# Altium schematic sheet Video out.SchDoc
size A4; SheetNumber: 13; SheetTotal: 16
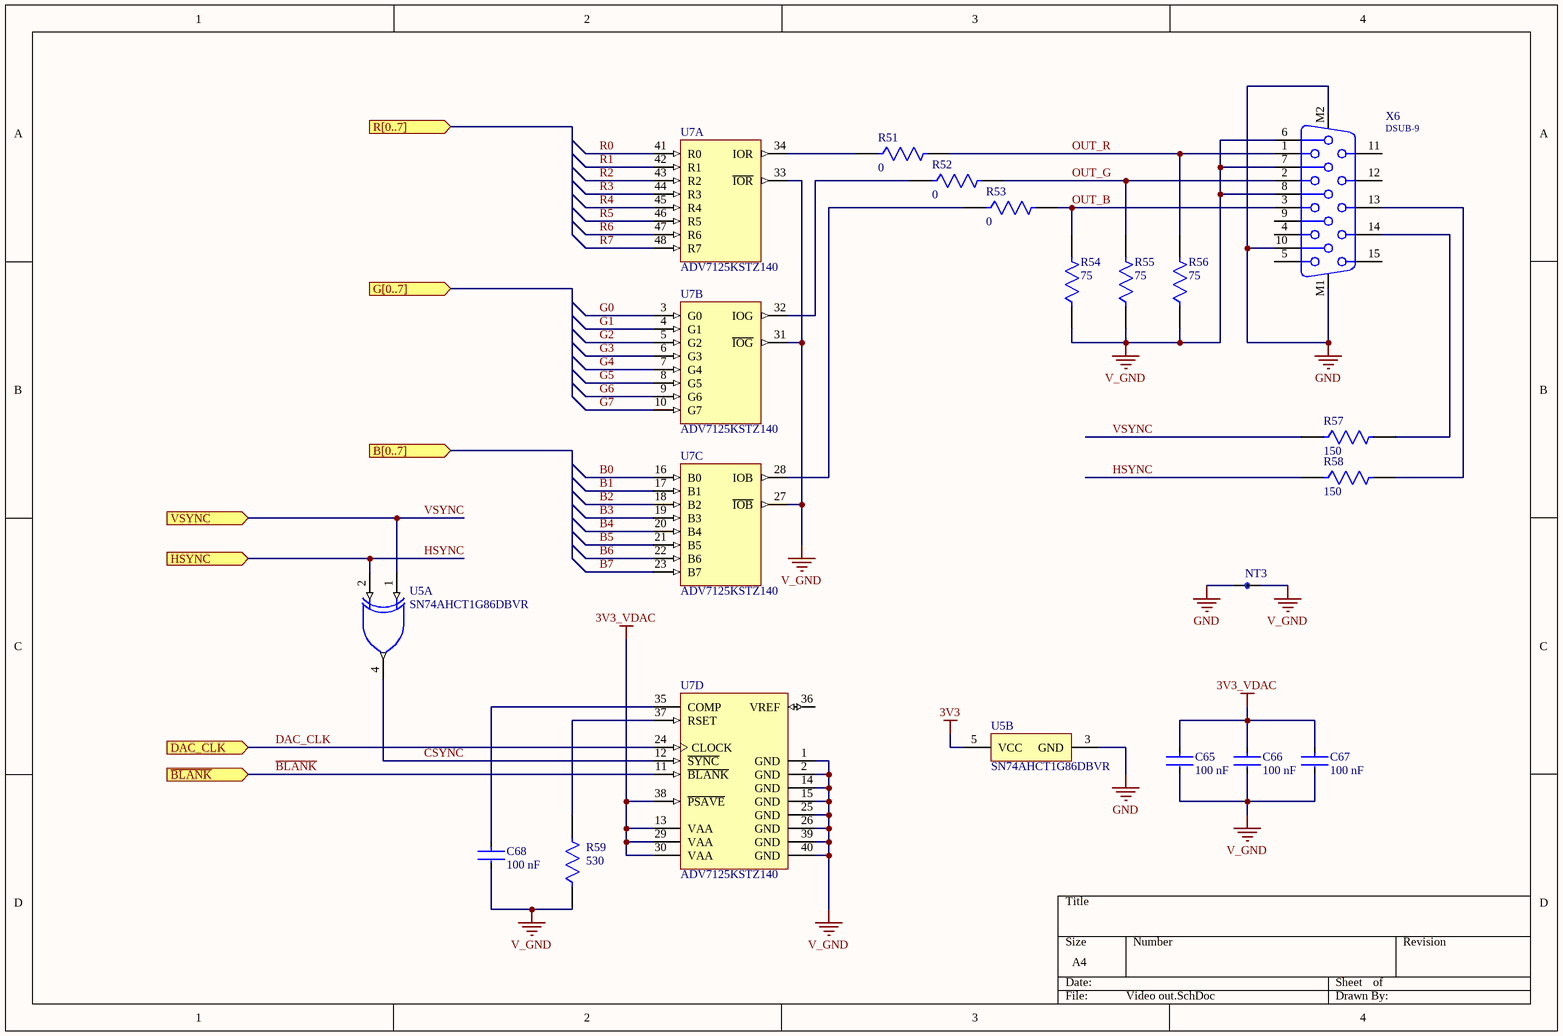
[diagram p0: Video out.SchDoc]

## Parts
C65  Capacitance: 100 nF  [CC0805]  (hidden comment: CC0805-1.5pF)
C66  Capacitance: 100 nF  [CC0805]  (hidden comment: CC0805-1.5pF)
C67  Capacitance: 100 nF  [CC0805]  (hidden comment: CC0805-1.5pF)
C68  Capacitance: 100 nF  [CC0805]  (hidden comment: CC0805-1.5pF)
NT3  net_tie  [NET_TIE]  (value not drawn)  (net tie, no BOM)
R51  Resistance: 0  [CR0805]  (hidden comment: CR0805-51)
R52  Resistance: 0  [CR0805]  (hidden comment: CR0805-51)
R53  Resistance: 0  [CR0805]  (hidden comment: CR0805-51)
R54  Resistance: 75  [CR0805]  (hidden comment: CR0805-51)
R55  Resistance: 75  [CR0805]  (hidden comment: CR0805-51)
R56  Resistance: 75  [CR0805]  (hidden comment: CR0805-51)
R57  Resistance: 150  [CR0805]  (hidden comment: CR0805-51)
R58  Resistance: 150  [CR0805]  (hidden comment: CR0805-51)
R59  Resistance: 530  [CR0805]  (hidden comment: CR0805-51)
U5  SN74AHCT1G86DBVR  [DBV0005A_L]  (parts A,B of 2)
U7  ADV7125KSTZ140  [ST-48_N]  (parts A,B,C,D of 4)
X6  DSUB-9  [618015330923]

## Ports
B[0..7] (in), DAC_CLK (in), G[0..7] (in), HSYNC (in), R[0..7] (in), VSYNC (in), ~{BLANK} (in)

## Nets
3V3: U5.5(VCC)
3V3_VDAC: C65.1 C66.1 C67.1 U7.13(VAA) U7.29(VAA) U7.30(VAA) U7.38(~{PSAVE})
GND: NT3.1 U5.3(GND) X6.10 X6.M1 X6.M2
V_GND: C65.2 C66.2 C67.2 C68.2 NT3.2 R54.1 R55.1 R56.1 R59.1 U7.1(GND) U7.2(GND) U7.14(GND) U7.15(GND) U7.25(GND) U7.26(GND) U7.27(~{IOB}) U7.31(~{IOG}) U7.33(~{IOR}) U7.39(GND) U7.40(GND) X6.6 X6.7 X6.8
B0: U7.16(B0)
B1: U7.17(B1)
B2: U7.18(B2)
B3: U7.19(B3)
B4: U7.20(B4)
B5: U7.21(B5)
B6: U7.22(B6)
B7: U7.23(B7)
~{BLANK}: U7.11(~{BLANK}) ; port ~{BLANK}
~{CSYNC}: U5.4(Y) U7.12(~{SYNC})
DAC_CLK: U7.24(CLOCK) ; port DAC_CLK
G0: U7.3(G0)
G1: U7.4(G1)
G2: U7.5(G2)
G3: U7.6(G3)
G4: U7.7(G4)
G5: U7.8(G5)
G6: U7.9(G6)
G7: U7.10(G7)
HSYNC: R58.1 U5.2(B) ; port HSYNC
OUT_B: R53.2 R54.2 X6.3
OUT_G: R52.2 R55.2 X6.2
OUT_R: R51.2 R56.2 X6.1
R0: U7.41(R0)
R1: U7.42(R1)
R2: U7.43(R2)
R3: U7.44(R3)
R4: U7.45(R4)
R5: U7.46(R5)
R6: U7.47(R6)
R7: U7.48(R7)
VSYNC: R57.1 U5.1(A) ; port VSYNC
NetC68_1: C68.1 U7.35(COMP)
NetR51_1: R51.1 U7.34(IOR)
NetR52_1: R52.1 U7.32(IOG)
NetR53_1: R53.1 U7.28(IOB)
NetR57_2: R57.2 X6.14
NetR58_2: R58.2 X6.13
NetR59_2: R59.2 U7.37(RSET)

Not connected (* = marked no-connect by the designer): U7 36(VREF); X6 4 5 9 11 12 15

## Library data of the parts
C65-C68 = CC0805: CL21 Series 0805 1.5pF 50V ±0.25pF Tolerance C0G Multilayer Ceramic Chip Capacitor; Manufacturer Part Number: CL21C1R5CBANNNC; Manufacturer: Samsung; value: 1.5pF; Category: Cap; Case/Package: 0805
R51-R59 = CR0805: 51Ω ±0.5% 0.1W 1/10W Chip Resistor 0805 (2012 Metric) Thin Film; Manufacturer: Susumu; Manufacturer Part Number: RR1220Q-510-D; Case/Package: 0805; Number of Pins: 2; Termination: SMD/SMT; value: 51Ω; Category: Res; Number of Terminations: 2
U5 = CMP-0859-00100-3: Single 2-Input Exclusive-OR Gate, DBV0005A, LARGE T&R; Manufacturer: Texas Instruments; VCC(Max)(V): 5.5; ICC @ Nom Voltage(Max)(mA): 0.01; Gate Type: XOR; Schmitt Trigger: No; tpd @ Nom Voltage(Max)(ns): 8; Voltage(Nom)(V): 5; Logic: True; Input Type: CMOS; F @ Nom Voltage(Max)(Mhz): 75; Output Drive (IOL/IOH)(Max)(mA): 8/-8; Sub-Family: XOR Gate; Rating: Catalog; Bits(#): 1; VCC(Min)(V): 2; Technology Family: AHCT; DatasheetVersion: SCLS324M; Generic Part Number: SN74AHCT1G86; 3-State Output: No; Output Type: CMOS; Operating Temperature Range(C): -40 to 125; PackageReference: DBV0005A
U7 = ADV7125KSTZ140: 3 Channel 8-Bit CMOS High Speed Video Digital-to-Analog Converter, -40 to +85 degC, ST-48, Pb-Free, Tray; Manufacturer: Analog Devices; PackageDescription: 48-Pin Thin Quad Flat Pack 0.5 mm Pitch; PartNumber: ADV7125KSTZ140; Manufacturer Part Number: ADV7125KSTZ140; value: ADV7125KSTZ140; Case/Package: TQFP-48; Category: IC
X6 = DSUB-9: Female High Density PCB Connector with Hex Screw WR-DSUB, Angled, 15 pins; Manufacturer: Wurth Electronics; Manufacturer Part Number: 618015330923; value: DSUB, Angled, 15 pins; Case/Package: DSUB-15; Category: Connector